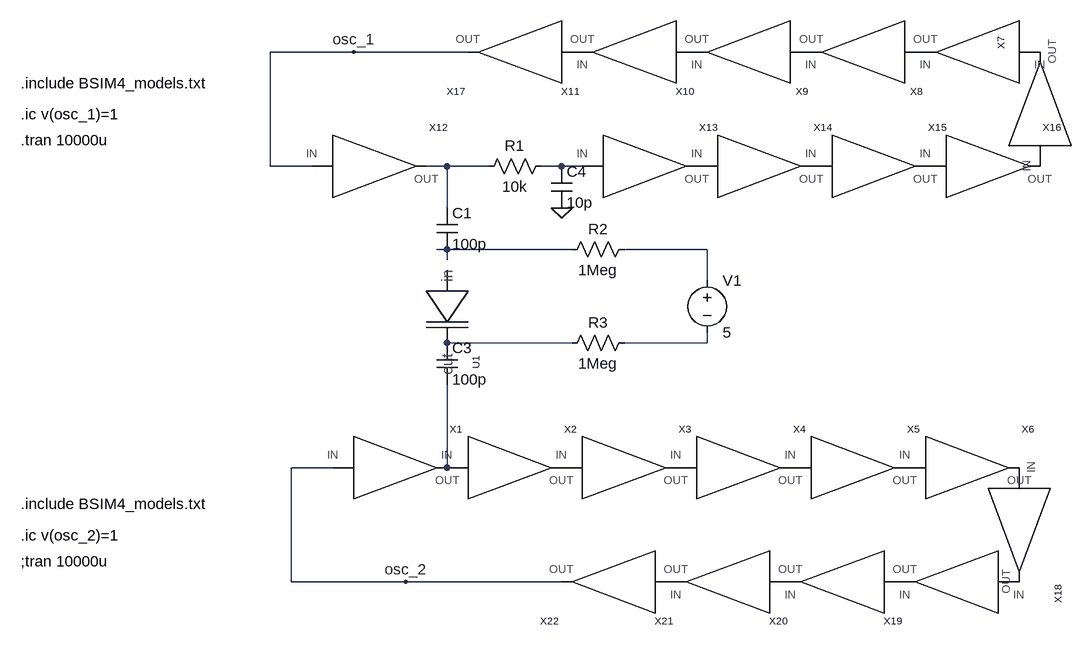
[diagram p0: schematic Ring_oscillator.asc]
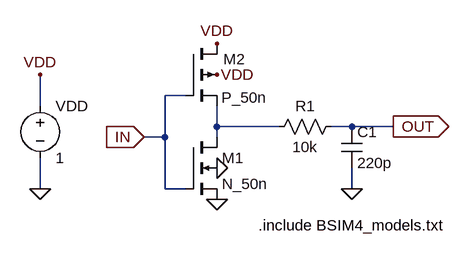
[diagram p1: sub-circuit cmos.asc]
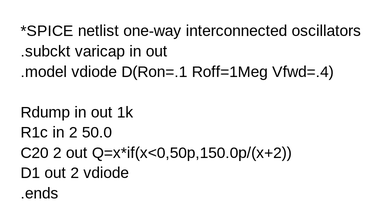
[diagram p2: sub-circuit varicap.asc]
Ring_oscillator.asc, the LTspice schematic file:
Version 4
SHEET 1 2020 888
WIRE -144 -640 -272 -640
WIRE 32 -640 -144 -640
WIRE -272 -464 -272 -640
WIRE -208 -464 -272 -464
WIRE 0 -464 -32 -464
WIRE 64 -464 0 -464
WIRE 176 -464 144 -464
WIRE 208 -464 176 -464
WIRE 0 -400 0 -464
WIRE 0 -336 -16 -336
WIRE 192 -336 0 -336
WIRE 400 -336 272 -336
WIRE 0 -320 0 -336
WIRE 400 -288 400 -336
WIRE 0 -192 0 -208
WIRE 192 -192 0 -192
WIRE 400 -192 400 -208
WIRE 400 -192 272 -192
WIRE -176 0 -240 0
WIRE 0 0 0 -128
WIRE -240 176 -240 0
WIRE -64 176 -240 176
WIRE 176 176 -64 176
FLAG -144 -640 osc_1
FLAG -64 176 osc_2
FLAG 176 -400 0
SYMBOL CMOS -96 0 R0
SYMATTR InstName X1
SYMBOL CMOS 80 0 R0
SYMATTR InstName X2
SYMBOL CMOS 256 0 R0
SYMATTR InstName X3
SYMBOL CMOS 432 0 R0
SYMATTR InstName X4
SYMBOL CMOS 608 0 R0
SYMATTR InstName X5
SYMBOL CMOS 784 0 R0
SYMATTR InstName X6
SYMBOL CMOS -128 -464 R0
SYMATTR InstName X12
SYMBOL CMOS 288 -464 R0
SYMATTR InstName X13
SYMBOL CMOS 464 -464 R0
SYMATTR InstName X14
SYMBOL CMOS 640 -464 R0
SYMATTR InstName X15
SYMBOL CMOS 816 -464 R0
SYMATTR InstName X16
SYMBOL CMOS 912 -544 R270
SYMATTR InstName X7
SYMBOL CMOS 880 80 R90
SYMATTR InstName X18
SYMBOL CMOS 800 176 R180
SYMATTR InstName X19
SYMBOL CMOS 624 176 R180
SYMATTR InstName X20
SYMBOL CMOS 448 176 R180
SYMATTR InstName X21
SYMBOL CMOS 272 176 R180
SYMATTR InstName X22
SYMBOL CMOS 832 -640 R180
SYMATTR InstName X8
SYMBOL CMOS 656 -640 R180
SYMATTR InstName X9
SYMBOL CMOS 480 -640 R180
SYMATTR InstName X10
SYMBOL CMOS 304 -640 R180
SYMATTR InstName X11
SYMBOL CMOS 128 -640 R180
SYMATTR InstName X17
SYMBOL res 160 -480 R90
WINDOW 0 0 56 VBottom 2
WINDOW 3 32 56 VTop 2
SYMATTR InstName R1
SYMATTR Value 10k
SYMBOL cap -16 -400 R0
SYMATTR InstName C1
SYMATTR Value 100p
SYMBOL cap -16 -192 R0
SYMATTR InstName C3
SYMATTR Value 100p
SYMBOL cap 160 -464 R0
SYMATTR InstName C4
SYMATTR Value 10p
SYMBOL AutoGenerated\\varicap 0 -272 R90
SYMATTR InstName U1
SYMBOL res 288 -352 R90
WINDOW 0 0 56 VBottom 2
WINDOW 3 32 56 VTop 2
SYMATTR InstName R2
SYMATTR Value 1Meg
SYMBOL res 288 -208 R90
WINDOW 0 0 56 VBottom 2
WINDOW 3 32 56 VTop 2
SYMATTR InstName R3
SYMATTR Value 1Meg
SYMBOL voltage 400 -304 R0
WINDOW 123 0 0 Left 0
WINDOW 39 0 0 Left 0
SYMATTR InstName V1
SYMATTR Value 5
TEXT -656 56 Left 2 !.include BSIM4_models.txt
TEXT -656 104 Left 2 !.ic v(osc_2)=1
TEXT -656 -592 Left 2 !.include BSIM4_models.txt
TEXT -656 -544 Left 2 !.ic v(osc_1)=1
TEXT -656 -504 Left 2 !.tran 10000u
TEXT -656 144 Left 2 !;tran 10000u

cmos.asc, the sub-circuit schematic file:
Version 4
SHEET 1 880 680
WIRE 48 208 16 208
WIRE -176 224 -176 176
WIRE 96 256 96 224
WIRE 192 256 96 256
WIRE 304 256 272 256
WIRE 368 256 304 256
WIRE 16 272 16 208
WIRE 16 272 -16 272
WIRE 96 272 96 256
WIRE -176 352 -176 304
WIRE 16 352 16 272
WIRE 48 352 16 352
WIRE 304 352 304 320
FLAG -176 176 VDD
FLAG 96 128 VDD
FLAG 96 176 VDD
FLAG -176 352 0
FLAG 96 368 0
FLAG 96 320 0
FLAG -16 272 IN
IOPIN -16 272 In
FLAG 368 256 OUT
IOPIN 368 256 Out
FLAG 304 352 0
SYMBOL pmos4 48 128 R0
WINDOW 0 58 24 Left 2
WINDOW 3 55 83 Left 2
SYMATTR InstName M2
SYMATTR Value P_50n
SYMATTR Value2 l=50n w=1u
SYMBOL nmos4 48 272 R0
SYMATTR InstName M1
SYMATTR Value N_50n
SYMATTR Value2 l=50n w=500n
SYMBOL voltage -176 208 R0
WINDOW 123 0 0 Left 0
WINDOW 39 0 0 Left 0
SYMATTR InstName VDD
SYMATTR Value 1
SYMBOL res 288 240 R90
WINDOW 0 0 56 VBottom 2
WINDOW 3 32 56 VTop 2
SYMATTR InstName R1
SYMATTR Value 10k
SYMBOL cap 288 256 R0
SYMATTR InstName C1
SYMATTR Value 220p
TEXT 160 408 Left 2 !.include BSIM4_models.txt

varicap.asc, the sub-circuit schematic file:
Version 4
SHEET 1 1188 680
TEXT -24 72 Left 2 !*SPICE netlist one-way interconnected oscillators\n.subckt varicap in out\n.model vdiode D(Ron=.1 Roff=1Meg Vfwd=.4)\n \nRdump in out 1k \nR1c in 2 50.0\nC20 2 out Q=x*if(x<0,50p,150.0p/(x+2))\nD1 out 2 vdiode\n.ends

The netlist it stands for:
* Ring_oscillator.asc
XX1 osc_2 N007 cmos
XX2 N007 P001 cmos
XX3 P001 P002 cmos
XX4 P002 P003 cmos
XX5 P003 P004 cmos
XX6 P004 P005 cmos
XX12 osc_1 N001 cmos
XX13 N002 P006 cmos
XX14 P006 P007 cmos
XX15 P007 P008 cmos
XX16 P008 P009 cmos
XX7 P009 P010 cmos
XX18 P005 P011 cmos
XX19 P011 P012 cmos
XX20 P012 P013 cmos
XX21 P013 P014 cmos
XX22 P014 osc_2 cmos
XX8 P010 P015 cmos
XX9 P015 P016 cmos
XX10 P016 P017 cmos
XX11 P017 P018 cmos
XX17 P018 osc_1 cmos
R1 N002 N001 10k
C1 N001 N003 100p
C3 N005 N007 100p
C4 N002 0 10p
XU1 varicap
R2 N004 N003 1Meg
R3 N006 N005 1Meg
V1 N004 N006 5

* block symbol definitions
.subckt cmos IN OUT
M2 VDD IN N001 VDD P_50n l=50n w=1u
M1 N001 IN 0 0 N_50n l=50n w=500n
VDD VDD 0 1
R1 OUT N001 10k
C1 OUT 0 220p
.include BSIM4_models.txt
.ends cmos

.subckt varicap 
*SPICE netlist one-way interconnected oscillators
.subckt varicap in out
.model vdiode D(Ron=.1 Roff=1Meg Vfwd=.4)
Rdump in out 1k
R1c in 2 50.0
C20 2 out Q=x*if(x<0,50p,150.0p/(x+2))
D1 out 2 vdiode
.ends
.ends varicap

.model NMOS NMOS
.model PMOS PMOS
.lib standard.mos
.include BSIM4_models.txt
.ic v(osc_2)=1
.include BSIM4_models.txt
.ic v(osc_1)=1
.tran 10000u
;tran 10000u
.backanno
.end